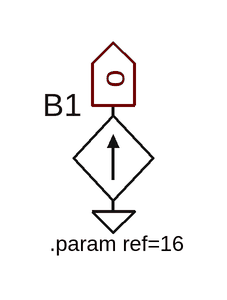
[diagram p0: schematic dac-4bit-fast.asc]
dac-4bit-fast.asc, the LTspice schematic file:
Version 4
SHEET 1 880 680
FLAG 224 -48 o
IOPIN 224 -48 Out
FLAG 224 32 0
SYMBOL bi 224 32 R180
WINDOW 0 24 80 Left 2
WINDOW 3 24 0 Invisible 0
SYMATTR InstName B1
SYMATTR Value I=8*V(in[3])+4*V(in[2])+2*V(in[1])+V(in[0])
SYMATTR Value2 Rpar={ref/16}
TEXT 176 56 Left 1 !.param ref=16

The netlist it stands for:
* dac-4bit-fast.asc
B1 0 o I=8*V(in[3])+4*V(in[2])+2*V(in[1])+V(in[0]) Rpar={ref/16}
.param ref=16
.backanno
.end